# Altium schematic sheet PAPOWER.SchDoc
size A4
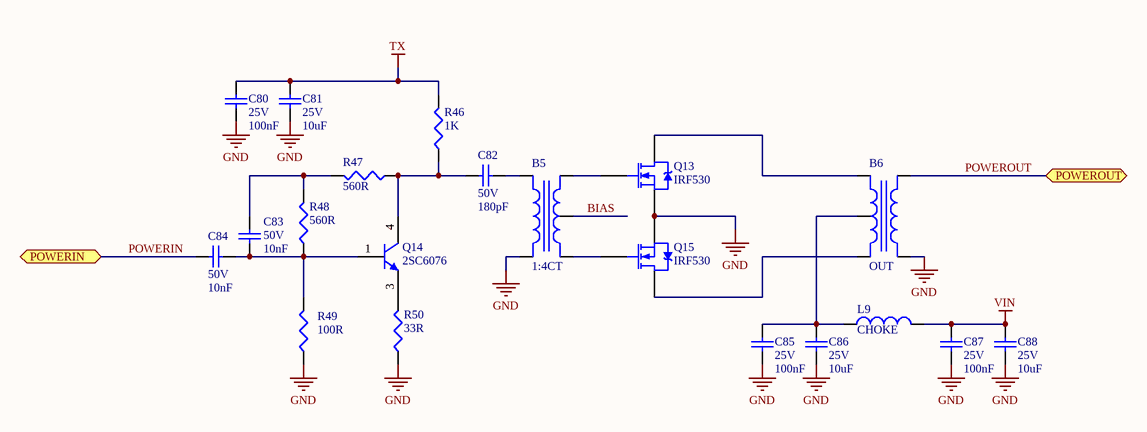
[diagram p0: PAPOWER.SchDoc]

## Parts
B5  1:4CT  [CX2047LANL]
B6  OUT  [T37-43-5]
C80  value 100nF  Tensão: 25V  [CC0603]  (hidden comment: Capacitor Cerâmico)
C81  value 10uF  Tensão: 25V  [CC0805]  (hidden comment: Capacitor Cerâmico)
C82  value 180pF  Tensão: 50V  [CC0603]  (hidden comment: Capacitor Cerâmico)
C83  value 10nF  Tensão: 50V  [CC0603]  (hidden comment: Capacitor Cerâmico)
C84  value 10nF  Tensão: 50V  [CC0603]  (hidden comment: Capacitor Cerâmico)
C85  value 100nF  Tensão: 25V  [CC0603]  (hidden comment: Capacitor Cerâmico)
C86  value 10uF  Tensão: 25V  [CC0805]  (hidden comment: Capacitor Cerâmico)
C87  value 100nF  Tensão: 25V  [CC0603]  (hidden comment: Capacitor Cerâmico)
C88  value 10uF  Tensão: 25V  [CC0805]  (hidden comment: Capacitor Cerâmico)
L9  CHOKE  [T37-43-2]
Q13  IRF530  [TO-220-3N]
Q14  2SC6076  [TO-252]
Q15  IRF530  [TO-220-3N]
R46  value 1K  [CC0805]  (hidden comment: Resistor)
R47  value 560R  [CC0603~0805]  (hidden comment: Resistor)
R48  value 560R  [CC0603~0805]  (hidden comment: Resistor)
R49  value 100R  [CC0805]  (hidden comment: Resistor)
R50  value 33R  [CC0603~0805]  (hidden comment: Resistor)

## Ports
POWERIN (bidir), POWEROUT (bidir)

## Nets
GND: B5.4(Pri+) B6.5(Sec-) C80.1 C81.1 C85.1 C86.1 C87.1 C88.1 Q13.3(S) Q15.3(S) R49.1 R50.1
TX: C80.2 C81.2 R46.2
VIN: C87.2 C88.2 L9.2
BIAS: B5.2(Sec+)
POWERIN: C84.1 ; port POWERIN
POWEROUT: B6.4(Pri+) ; port POWEROUT
NetB5_1: B5.1(Sec+) Q13.1(G)
NetB5_3: B5.3(Pri-) Q15.1(G)
NetB5_6: B5.6(Sec-) C82.2
NetB6_1: B6.1(Pri-) Q13.2(D)
NetB6_2: B6.2(Sec+) C85.2 C86.2 L9.1
NetB6_3: B6.3(Sec+) Q15.2(D)
NetC82_1: C82.1 Q14.4(C) R46.1 R47.1
NetC83_1: C83.1 C84.2 Q14.1(B) R48.1 R49.2
NetC83_2: C83.2 R47.2 R48.2
NetQ14_3: Q14.3(E) R50.2

## Library data of the parts
B5 = BALUN CX2047LANL: Balun 4CT:1; ChinesePrice: 0,00000; Chinês: ----; Corrente: *; Potência: *; Supplier 1: Digi-Key; Supplier Part Number 1: 553-2770-1-ND; Tensão: *; Obs:: *; Tolerância: *; ComponentLink1Description: Datasheet; ComponentLink1URL: D:\Tecnoclade\Datasheet\!DataMissing.pdf; Substituição: 00/00/0000; Value: *
B6 = BALUN OUTPUT: Balun PA; ChinesePrice: 0,00000; Chinês: ----; Corrente: *; Potência: *; Supplier 1: Digi-Key; Tensão: *; Obs:: *; Tolerância: *; ComponentLink1Description: Datasheet; ComponentLink1URL: D:\Tecnoclade\Datasheet\!DataMissing.pdf; Substituição: 00/00/0000; Value: *
C80 C85 C87 = Cap 100nF 25V 0603 X7R: Capacitor (Semiconductor SIM Model); Chinês: Local; ChinesePrice: 0,00246; Corrente: *A; Potência: *W; Obs:: X7R; Tolerância: ±10%; Supplier 1: Digi-Key; Supplier Part Number 1: 490-1524-1-ND; ComponentLink1Description: Datasheet; ComponentLink1URL: D:\Tecnoclade\Datasheet\!DataMissing.pdf
C81 C86 C88 = Cap 10uF 25V 0805 X5R: Capacitor (Semiconductor SIM Model); Chinês: Local; ChinesePrice: 0,02620; Corrente: *A; Potência: *W; Obs:: X5R; Tolerância: ±10%; Supplier 1: Digi-Key; Supplier Part Number 1: 587-2985-1-ND; ComponentLink1Description: Datasheet; ComponentLink1URL: D:\Tecnoclade\Datasheet\!DataMissing.pdf
C82 = Cap 180pF 50V 0603 NP0: Capacitor (Semiconductor SIM Model); Chinês: Local; ChinesePrice: 0,00360; Corrente: *A; Potência: *W; Obs:: NP0; Tolerância: ±5%; Supplier 1: Digi-Key; Supplier Part Number 1: 1276-1255-1-ND; ComponentLink1Description: Datasheet; ComponentLink1URL: D:\Tecnoclade\Datasheet\!DataMissing.pdf
C83 C84 = Cap 10nF 50V 0603 X7R 5%: Capacitor (Semiconductor SIM Model); Chinês: Local; ChinesePrice: 0,00320; Corrente: *A; Potência: *W; Obs:: X7R; Tolerância: ±5%; Supplier 1: Digi-Key; Supplier Part Number 1: 399-1092-1-ND; ComponentLink1Description: Datasheet; ComponentLink1URL: D:\Tecnoclade\Datasheet\!DataMissing.pdf
L9 = CHOKE: Bead; ChinesePrice: 0,00000; Chinês: -----; Obs:: Ferrite (0R5); Tolerância: ±25%; Potência: *; Supplier 1: Digi-Key; Tensão: *; ComponentLink1Description: Datasheet; ComponentLink1URL: D:\Tecnoclade\Datasheet\!DataMissing.pdf; Substituição: 27/06/2014
Q13 Q15 = TRS IRF530 100V 14A TO-220: N-Channel Power MOSFET; ChinesePrice: 0,00000; Chinês: ----; Corrente: *; Potência: *; Supplier 1: Digi-Key; Supplier Part Number 1: IRF530PBF-ND; Tensão: *; Value: *; Obs:: *; Tolerância: *; ComponentLink1Description: Datasheet; ComponentLink1URL: D:\Tecnoclade\Datasheet\!DataMissing.pdf
Q14 = TRS 2SC6076 160V 3A TO-252: NPN General Purpose Amplifier; Tensão: 40V; Corrente: 600mA; Potência: 350mW; Chinês: ----; ChinesePrice: 0,00000; Value: 150Mhz; Supplier 1: Digi-Key; Supplier Part Number 1: 2SC6076(TE16L1NV)CT-ND; Obs:: *; Tolerância: *; ComponentLink1Description: Datasheet; ComponentLink1URL: D:\Tecnoclade\Datasheet\!DataMissing.pdf
R46 = Res 1K 1% 0805 1/8W: ChinesePrice: 0,00000; Chinês: ----; Corrente: *A; Potência: 1/8W; Tensão: *V; Tolerância: ±1%; Supplier 1: Digi-Key; Supplier Part Number 1: RMCF0805FT1K00CT-ND; Obs: *; ComponentLink1Description: Datasheet; ComponentLink1URL: D:\Tecnoclade\Datasheet\!DataMissing.pdf
R47 R48 = Res 560R 1% 0603 1/8W: ChinesePrice: 0,00000; Chinês: ----; Corrente: *A; Potência: 1/8W; Tensão: *V; Tolerância: ±1%; Supplier 1: Digi-Key; Supplier Part Number 1: MCT0603-560-CFCT-ND; Obs: *; ComponentLink1Description: Datasheet; ComponentLink1URL: D:\Tecnoclade\Datasheet\!DataMissing.pdf
R49 = Res 100R 5% 0805 1/8W: ChinesePrice: 0,00150; Chinês: Local; Corrente: *A; Potência: 1/8W; Tensão: *V; Obs: ±200ppm/ºC; Tolerância: ±5%; Supplier 1: Digi-Key; Supplier Part Number 1: RMCF0805JT100RCT-ND; ComponentLink1Description: Datasheet; ComponentLink1URL: D:\Tecnoclade\Datasheet\!DataMissing.pdf
R50 = Res 33R 1% 0603 1/10W: ChinesePrice: 0,00000; Chinês: ----; Corrente: *A; Potência: 1/10W; Tensão: *V; Obs: ±100ppm/ºC; Tolerância: ±1%; Supplier 1: Digi-Key; Supplier Part Number 1: P33.0HCT-ND; ComponentLink1Description: Datasheet; ComponentLink1URL: D:\Tecnoclade\Datasheet\!DataMissing.pdf